# EasyEDA Pro project 2025_08_26_usb2uart.epro

# Schematic Schematic1
Board Name: Board1; Create Date: 2025-08-26; Page Name: P1; Project Name: 2025_08_26_usb2uart; Schematic Name: Schematic1; Update Date: 2025-08-26; Company: EasyEDA.com; Page Size: A4; Version: V1.0
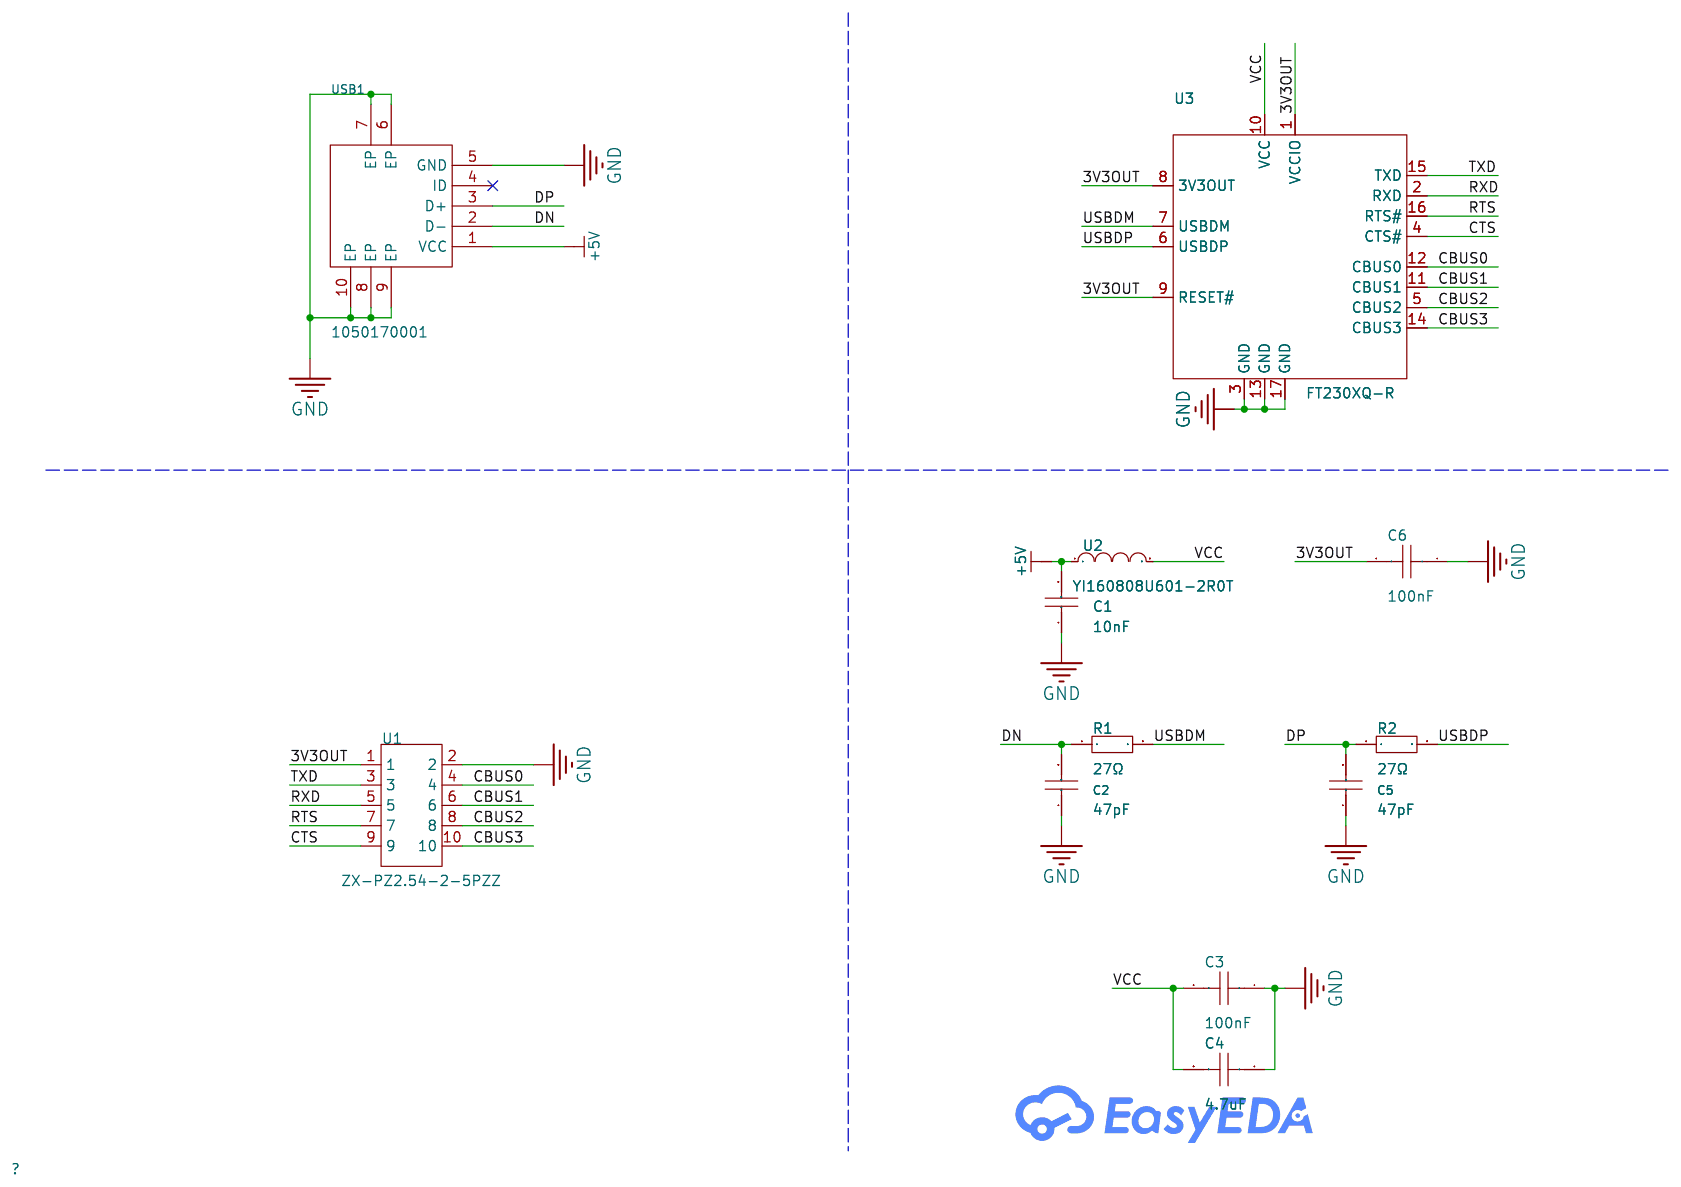
[diagram p0: schematic sheet]

## Parts
C1  10nF  [C0402]
C2  47pF  [C0402]
C3  100nF  [C0402]
C4  4.7uF  [C0402]
C5  47pF  [C0402]
C6  100nF  [C0402]
R1  27Ω  [R0402]
R2  27Ω  [R0402]
U1  ZX-PZ2.54-2-5PZZ  [HDR-TH_10P-P2.54-V-M-R2-C5-S2.54]
U2  YI160808U601-2R0T  [L0603]
U3  FT230XQ-R  [QFN-16_L4.0-W4.0-P0.65-BL-EP2.2]
USB1  1050170001  [MICRO-USB-SMD_105017-0001]

## Library data of the parts
C1 = CL05B103KB5NNNC: Capacitance:10nF Tolerance:±10% Tolerance:±10% Voltage Rating:50V Temperature Coefficient:X7R; LCSC Part Name: 10nF ±10% 50V; Supplier Part: C15195; Manufacturer: SAMSUNG(三星); Supplier Footprint: 0402; Datasheet: https://item.szlcsc.com/datasheet/CL05B103KB5NNNC/15869.html; Supplier: LCSC; Tolerance: ±10%; Voltage Rating: 50V; Temperature Coefficient: X7R
C2 C5 = CC0402JRNPO9BN470: Capacitance: Tolerance:±5% Tolerance:±5% Voltage Rated: Temperature Coefficient:; LCSC Part Name: 47pF ±5% 50V; Supplier Part: C60137; Manufacturer: YAGEO(国巨); Supplier Footprint: 0402; JLCPCB Part Class: Extended Part; Datasheet: https://atta.szlcsc.com/upload/public/pdf/source/20170505/1493957838062.pdf; Supplier: LCSC; Tolerance: ±5%
C3 C6 = CL05B104KO5NNNC: Capacitance: Tolerance:±10% Tolerance:±10% Voltage Rated: Temperature Coefficient:; LCSC Part Name: 100nF ±10% 16V; Supplier Part: C1525; Manufacturer: SAMSUNG(三星); Supplier Footprint: 0402; JLCPCB Part Class: Basic Part; Datasheet: https://atta.szlcsc.com/upload/public/pdf/source/20160218/1457707763339.pdf; Supplier: LCSC; Tolerance: ±10%
C4 = CL05A475MQ5NRNC_C307423: Capacitance:4.7uF Tolerance:±20% Tolerance:±20% Voltage Rating:6.3V Temperature Coefficient:X5R; LCSC Part Name: 4.7uF ±20% 6.3V; Supplier Part: C307423; Manufacturer: SAMSUNG(三星); Manufacturer Part: CL05A475MQ5NRNC; Supplier Footprint: 0402; JLCPCB Part Class: Extended Part; Datasheet: https://item.szlcsc.com/datasheet/CL05A475MQ5NRNC/291097.html; Supplier: LCSC; Tolerance: ±20%; Voltage Rating: 6.3V; Temperature Coefficient: X5R
R1 R2 = RC0402FR-0727RL: Type:Thick Film Resistor Resistance:27Ω Tolerance:±1% Tolerance:±1% Power(Watts):62.5mW Voltage-Supply(Max):50V Temperature Coefficient:±100ppm/℃ Temperature Coefficient:±100ppm/℃ Operating Temperature:-55℃~+155℃ Operating Temperature:-55℃~+155℃; LCSC Part Name: 厚膜电阻 27Ω ±1% 62.5mW; Supplier Part: C138021; Manufacturer: YAGEO(国巨); Supplier Footprint: 0402; Datasheet: https://item.szlcsc.com/datasheet/RC0402FR-0727RL/149337.html; Supplier: LCSC; Type: Thick Film Resistor; Tolerance: ±1%; Power(Watts): 62.5mW; Voltage-Supply(Max): 50V; Temperature Coefficient: ±100ppm/℃; Operating Temperature: -55℃~+155℃
U1 = ZX-PZ2.54-2-5PZZ: Pin Structure:2x5P Pitch:2.54mm Row Spacing:2.54mm Circluar Pins/Square Pins:Pin Header Mounting Type:Through Hole Number of Rows:2 Number of Pins:10P Current Rating:3A Voltage Rating (Max):1kV Length of Mating Pin:6mm Insulation Height:2.5mm Length of En; LCSC Part Name: 2x5P 间距:2.54mm 方针 直插; Supplier Part: C7501276; Manufacturer: Megastar(兆星); Supplier Footprint: 插件,P=2.54mm; JLCPCB Part Class: Extended Part; Datasheet: https://item.szlcsc.com/datasheet/ZX-PZ2.54-2-5PZZ/8582489.html; Supplier: LCSC; Pin Structure: 2x5P; Pitch: 2.54mm; Row Spacing: 2.54mm; Circluar Pins/Square Pins: Pin Header; Mounting Type: Through Hole; Number of Rows: 2; Number of Pins: 10P; Current Rating: 3A; Voltage Rating (Max): 1kV; Length of Mating Pin: 6mm; Insulation Height: 2.5mm; Length of End Connection Pin: 3mm; Contact Material: Brass; Contact Plating: Gold; Operating Temperature: -40℃~+105℃; Color: Black
U2 = YI160808U601-2R0T: Impedance @ Frequency:600Ω@100MHz Tolerance:±25% Tolerance:±25% DC Resistance(DCR):0.1Ω Current Rating:2A Number of Circuits:1; LCSC Part Name: 0603磁珠 阻抗600Ω@100MHz; Supplier Part: C2971884; Manufacturer: YJYCOIN(益嘉源); Supplier Footprint: 0603; JLCPCB Part Class: Extended Part; Datasheet: https://atta.szlcsc.com/upload/public/pdf/source/20220124/1581248EA3A72409846849DDE53A1B42.pdf; Supplier: LCSC; Impedance @ Frequency: 600Ω@100MHz; Tolerance: ±25%; DC Resistance(DCR): 0.1Ω; Current Rating: 2A; Number of Circuits: 1
U3 = FT230XQ-R: Applications Function:USB to UART Protocol:- Voltage - Supply:3.3V~5V Voltage - Supply:3.3V~5V Operating Temperature:-40℃~+85℃ Operating Temperature:-40℃~+85℃; LCSC Part Name: FT230X USB到基本UART IC; Supplier Part: C128629; Manufacturer: FTDI(飞特帝亚); Supplier Footprint: QFN-16-EP(4x4); JLCPCB Part Class: Extended Part; Datasheet: https://item.szlcsc.com/datasheet/FT230XQ-R/139914.html; Supplier: LCSC; Applications Function: USB to UART; Voltage - Supply: 3.3V~5V; Operating Temperature: -40℃~+85℃
USB1 = 1050170001: Connector Type:Micro-B Standard:USB 2.0 Gender:Female Number of Ports:1 Number of Contacts:5P Mounting Style:卧贴 Current Rating - Power (Max):- Operating Temperature Range:-30℃~+85℃ Operating Temperature Range:-30℃~+85℃; LCSC Part Name: Micro-B 母 卧贴; Supplier Part: C136000; Manufacturer: MOLEX; Supplier Footprint: SMD; JLCPCB Part Class: Extended Part; Datasheet: https://atta.szlcsc.com/upload/public/pdf/source/20171113/C136000_15105610884381115465.pdf; Supplier: LCSC; Connector Type: Micro-B; Standard: USB 2.0; Gender: Female; Number of Ports: 1; Number of Contacts: 5P; Mounting Style: 卧贴; Operating Temperature Range: -30℃~+85℃

## Nets
3V3OUT: C6.2 U1.1 U3.1(VCCIO) U3.8(3V3OUT) U3.9(RESET#)
+5V: C1.2 U2.1 USB1.1(VCC)
GND: C1.1 C2.1 C3.1 C4.1 C5.1 C6.1 U1.2 U3.3(GND) U3.13(GND) U3.17(GND) USB1.5(GND) USB1.6(EP) USB1.7(EP) USB1.8(EP) USB1.9(EP) USB1.10(EP)
VCC: C3.2 C4.2 U2.2 U3.10(VCC)
CBUS0: U1.4 U3.12(CBUS0)
CBUS1: U1.6 U3.11(CBUS1)
CBUS2: U1.8 U3.5(CBUS2)
CBUS3: U1.10 U3.14(CBUS3)
CTS: U1.9 U3.4(CTS#)
DN: C2.2 R1.1 USB1.2(D-)
DP: C5.2 R2.1 USB1.3(D+)
RTS: U1.7 U3.16(RTS#)
RXD: U1.5 U3.2(RXD)
TXD: U1.3 U3.15(TXD)
USBDM: R1.2 U3.7(USBDM)
USBDP: R2.2 U3.6(USBDP)

Not connected (* = marked no-connect by the designer): USB1 4(ID)*

# Board PCB1
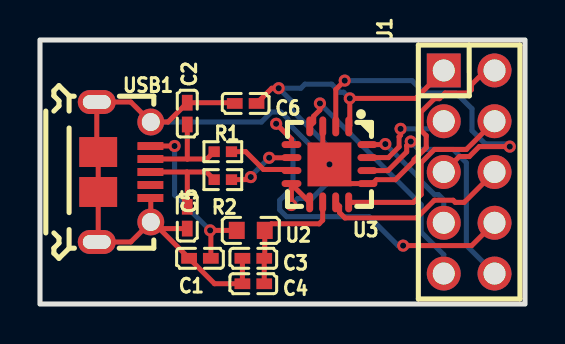
[diagram p1: board, top side]
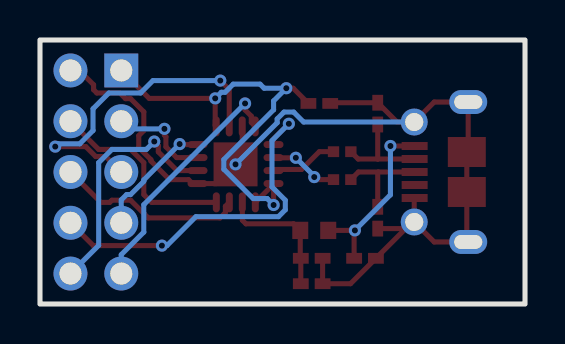
[diagram p2: board, bottom side, seen from below]

Outline 24.26 x 13.21 mm; copper layers: Top Layer, Bottom Layer. Coordinates in mm from the lower left corner of the outline.
Outline path: rectangle 0,13.21 24.26,0
Stack: Top Layer 0.035mm / Dielectric1 1.51mm FR4 er 4.5 / Bottom Layer 0.035mm

## Design rules (mm)
template: JLCPCB Capability(Two Layers Board)
spacing copperThickness1oz (default): track to track 0.102, other pairs 0.152 to 0.3
spacing copperThickness2oz: track to track 0.203, other pairs 0.152 to 0.3
track width copperThickness1oz (default): min 0.127, default 0.254, max 2.54
track width copperThickness2oz: min 0.203, default 0.254, max 2.54
differential pair differentialPair (default): width min 0.127, default 0.254, max 2.54; gap min 0.152, default 0.152
via viaSize (default): diameter min 0.5, default 0.61, max 10; hole min 0.3, default 0.305, max 6.3

## Placement (name value [footprint] x y rotation side)
C1  10nF  [C0402]  8 2.29 0 top
C2  47pF  [C0402]  7.37 9.52 270 top
C3  100nF  [C0402]  10.67 2.29 0 top
C4  4.7uF  [C0402]  10.67 1.02 0 top
C5  47pF  [C0402]  7.37 4.32 90 top
C6  100nF  [C0402]  10.29 10.03 0 top
R1  27Ω  [R0402]  9.14 7.62 0 top
R2  27Ω  [R0402]  9.14 6.22 0 top
U1  ZX-PZ2.54-2-5PZZ  [HDR-TH_10P-P2.54-V-M-R2-C5-S2.54]  21.46 6.6 270 top
U2  YI160808U601-2R0T  [L0603]  10.54 3.68 0 top
U3  FT230XQ-R  [QFN-16_L4.0-W4.0-P0.65-BL-EP2.2]  14.48 6.98 180 top
USB1  1050170001  [MICRO-USB-SMD_105017-0001]  4.19 6.6 270 top

## Footprints (pads in the part's own frame, mm; a bottom-side part is the same pattern mirrored in y, then rotated)
C0402
  rect 0.79x0.54 smd: 1(-0.545,0) 2(0.545,0)
HDR-TH_10P-P2.54-V-M-R2-C5-S2.54
  rect 1.7x1.7 hole 1.1: 1(-5.08,-1.27)
  round 1.7 hole 1.1: 2(-5.08,1.27) 3(-2.54,-1.27) 4(-2.54,1.27) 5(0,-1.27) 6(0,1.27) 7(2.54,-1.27) 8(2.54,1.27) 9(5.08,-1.27) 10(5.08,1.27)
L0603
  rect 0.8x0.864 smd: 1(-0.7,0) 2(0.7,0)
MICRO-USB-SMD_105017-0001
  rect 0.4x1.3 smd: 1(-1.3,1.33) 2(-0.65,1.33) 3(0,1.33) 4(0.65,1.33) 5(1.3,1.33)
  round 1.35 hole 0.9: 6(-2.5,1.35) 7(2.5,1.35)
  oval 1.2x1.9 hole 0.7x1.4: 8(3.5,-1.35) 9(-3.5,-1.35)
  rect 1.5x1.9 smd: 10(-1,-1.28) 10(1,-1.28)
QFN-16_L4.0-W4.0-P0.65-BL-EP2.2
  oval 0.35x1 smd: 1(-0.965,-1.9) 2(-0.315,-1.9) 3(0.336,-1.9) 4(0.986,-1.9) 9(0.991,1.9) 10(0.341,1.9) 11(-0.31,1.9) 12(-0.96,1.9)
  oval 1x0.35 smd: 5(1.9,-0.991) 6(1.9,-0.341) 7(1.9,0.31) 8(1.9,0.96) 13(-1.9,0.96) 14(-1.9,0.31) 15(-1.9,-0.341) 16(-1.9,-0.991)
  rect 2.2x2.2 smd: 17(0,0)
R0402
  rect 0.566x0.54 smd: 1(-0.433,0) 2(0.433,0)

## Nets
As in the schematic.

Pads without a net: USB1 4

## Via types
v1: diameter 0.61, hole 0.305, Top Layer to Bottom Layer, 16 vias

## Routing (per net, layer and track width the routed paths; a pad name or vN(x,y) marks a point on that pad's centre or on a via; arc(x,y) is an arc through that point)
3V3OUT: length 23
  Top Layer w0.254: U3.9 12.58,5.99 U3.8 12.57,6.02 v1(12.57,4.95) ; v1(11.94,10.8) 11.59,10.8 C6.2 ; U3.1 15.49,8.94 v1(15.49,10.29) 18.8,10.29 U1.1
  Bottom Layer w0.254: v1(12.57,4.95) 12.9,5.28 13.59,5.28 15.06,6.74 15.06,7.23 12.57,9.72 12.57,10.16 v1(11.94,10.8) 13.05,10.8 13.25,11 14.59,11 15,10.59 15.19,10.59 v1(15.49,10.29)
+5V: length 8.9
  Top Layer w0.254: 5.52,7.9 v1(6.73,7.9) ; U2.1 v1(8.51,3.68) 8.55,3.65 C1.2
  Bottom Layer w0.254: v1(6.73,7.9) 6.73,5.46 v1(8.51,3.68)
GND: length 52.6
  Top Layer w0.254: USB1.7 5.54,5.28 5.52,5.3 ; USB1.7 5.64,4.1 5.97,3.77 ; USB1.7 4.54,3.1 USB1.8 2.91,3.17 USB1.10 USB1.10 2.84,7.67 USB1.9 4.54,10.1 USB1.6 6.4,9.1 C2.1 9.71,10.07 C6.1 ; 5.97,3.77 C1.1 8.73,1.02 C4.1 C3.1 ; 5.97,3.77 C5.1 ; U3.3 14.14,7.32 v1(14.48,6.98) 15.44,6.02 U3.13 16.63,6.02 16.83,6.22 17.78,6.22 18.71,7.15 18.71,7.22 19.32,7.83 19.32,8.42 19.06,8.68 19.06,9.61 19.73,10.27 19.98,10.27 20.26,10.55 21.41,10.55 21.58,10.72 21.58,10.97 22.29,11.68 U1.2
  Bottom Layer w0.254: USB1.6 11.07,9.1 11.57,9.6 12.05,9.6 12.4,9.26 12.4,9.07 v1(14.48,6.98)
VCC: length 6.7
  Top Layer w0.254: C4.2 C3.2 11.24,2.31 U2.2 11.57,4.01 13.96,4.01 14.14,4.19 U3.10
CBUS0: length 9.9
  Top Layer w0.254: U1.4 21.32,7.73 19.73,7.73 19.06,7.07 19.06,5.47 18.67,5.08 U3.12
CBUS1: length 9.5
  Top Layer w0.254: U1.6 21.21,5.08 20.77,5.08 20.66,5.19 19.73,5.19 18.84,4.31 15.25,4.31 14.98,4.57 14.98,4.89 U3.11
CBUS2: length 18.2
  Top Layer w0.254: U3.5 12.58,8.25 v1(11.81,9.02) ; U1.8 21.59,2.92 v1(18.16,2.92)
  Bottom Layer w0.254: v1(18.16,2.92) 17.91,2.92 16.46,4.37 12.33,4.37 11.99,4.71 11.99,5.19 12.65,5.86 12.65,8.17 v1(11.81,9.02)
CBUS3: length 12.3
  Top Layer w0.254: U3.14 17.4,6.67 18.34,7.61 18.34,7.92 v1(18.54,8.13)
  Bottom Layer w0.254: U1.10 21.32,2.94 21.32,7.07 20.66,7.73 18.94,7.73 v1(18.54,8.13)
CTS: length 12.4
  Top Layer w0.254: v1(14,10.03) 14,9.71 13.69,9.4 13.69,9.08 U3.4
  Bottom Layer w0.254: U1.9 20.19,2.47 19.06,3.6 19.06,4.97 v1(14,10.03)
DN: length 5.1
  Top Layer w0.254: 7.36,7.25 8.35,7.25 R1.1 ; 7.36,7.25 7.37,7.26 C2.2 ; 7.36,7.25 5.52,7.25
DP: length 5.1
  Top Layer w0.254: 7.34,6.6 5.52,6.6 ; 7.34,6.6 7.37,6.58 C5.2 ; 7.34,6.6 8.33,6.6 R2.1
RTS: length 6.2
  Top Layer w0.254: U3.16 17.25,7.98 v1(17.27,8)
  Bottom Layer w0.254: v1(17.27,8) 19.06,6.21 19.06,6.14 19.73,5.47 19.93,5.47 20.19,5.21 U1.7
RXD: length 16.6
  Top Layer w0.254: v1(23.5,7.87) 21.97,7.87 21.47,7.38 20.97,7.38 U1.5 ; U3.2 14.79,10.73 v1(15.24,11.18)
  Bottom Layer w0.254: v1(15.24,11.18) 18.61,11.18 19.23,10.55 20.81,10.55 21.6,9.77 21.6,8.68 22.27,8.02 23.35,8.02 v1(23.5,7.87)
TXD: length 5.1
  Top Layer w0.254: v1(18.03,8.76) 18.03,8.45 17.96,8.37 17.96,7.86 17.42,7.33 U3.15
  Bottom Layer w0.254: U1.3 19.81,8.76 v1(18.03,8.76)
USBDM: length 3.4
  Top Layer w0.254: R1.2 10.29,7.62 11.18,6.73 12.52,6.73 U3.7
USBDP: length 3.5
  Top Layer w0.254: R2.2 10.41,6.22 v1(10.54,6.35) ; v1(11.46,7.31) 12.57,7.31 U3.6
  Bottom Layer w0.254: v1(11.46,7.31) 10.54,6.39 v1(10.54,6.35)
